# EasyEDA Pro project G474VET6_Penguins_v1.0.eprj

# Schematic Schematic1
Board Name: Board1
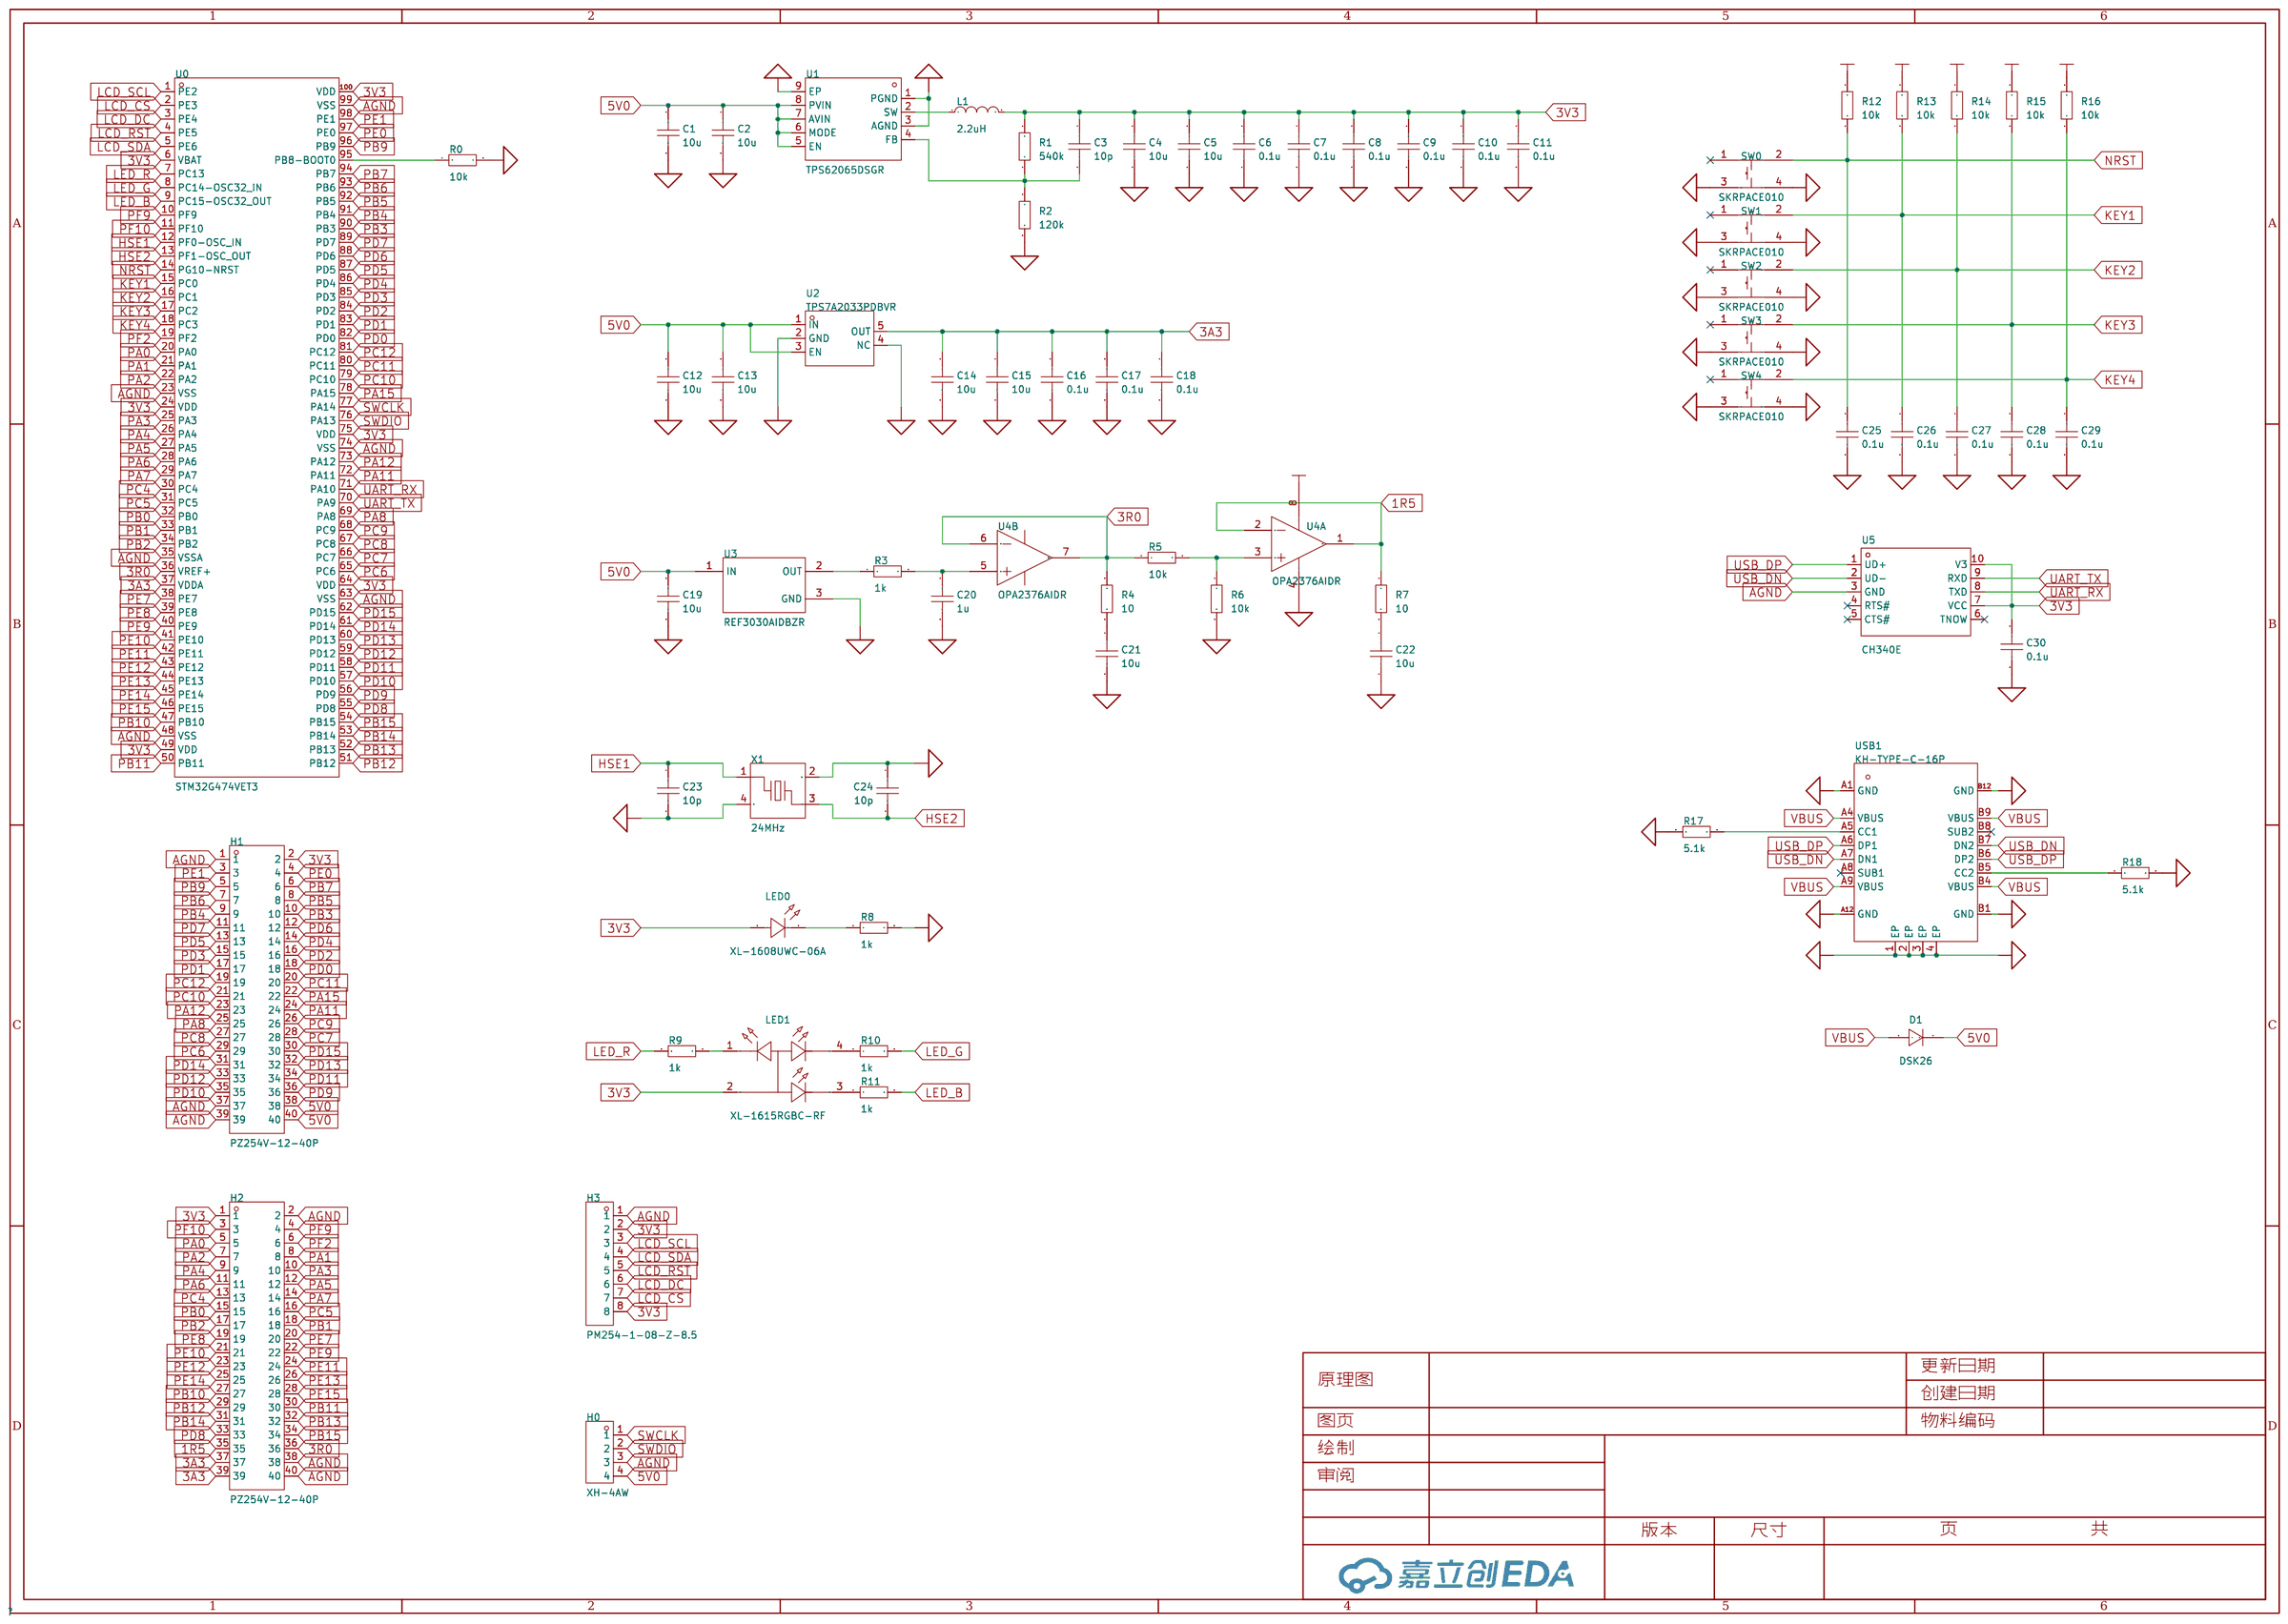
[diagram p0: schematic sheet]

## Parts
C1  10u  [R0603]
C2  10u  [R0603]
C3  10p  [R0603]
C4  10u  [R0603]
C5  10u  [R0603]
C6  0.1u  [R0603]
C7  0.1u  [R0603]
C8  0.1u  [R0603]
C9  0.1u  [R0603]
C10  0.1u  [R0603]
C11  0.1u  [R0603]
C12  10u  [R0603]
C13  10u  [R0603]
C14  10u  [R0603]
C15  10u  [R0603]
C16  0.1u  [R0603]
C17  0.1u  [R0603]
C18  0.1u  [R0603]
C19  10u  [R0603]
C20  1u  [R0603]
C21  10u  [R0603]
C22  10u  [R0603]
C23  10p  [R0603]
C24  10p  [R0603]
C25  0.1u  [R0603]
C26  0.1u  [R0603]
C27  0.1u  [R0603]
C28  0.1u  [R0603]
C29  0.1u  [R0603]
C30  0.1u  [R0603]
D1  DSK26  [SOD-123_L2.8-W1.8-LS3.7-RD]
H0  XH-4AW  [CONN-TH_XH-4AW]
H1  PZ254V-12-40P  [HDR-TH_40P-P2.54-V-M-R2-C20-S2.54_2-146257-0]
H2  PZ254V-12-40P  [HDR-TH_40P-P2.54-V-M-R2-C20-S2.54_2-146257-0]
H3  PM254-1-08-Z-8.5  [HDR-TH_8P-P2.54-V-F]
L1  2.2uH  [IND-SMD_L2.5-W2.0]
LED0  XL-1608UWC-06A  [LED0603-RD_1]
LED1  XL-1615RGBC-RF  [LED-ARRAY-SMD_4P-L1.6-W1.5-BR_XL-1615RGBC-RF]
R0  10k  [R0603]
R1  540k  [R0603]
R2  120k  [R0603]
R3  1k  [R0603]
R4  10  [R0603]
R5  10k  [R0603]
R6  10k  [R0603]
R7  10  [R0603]
R8  1k  [R0603]
R9  1k  [R0603]
R10  1k  [R0603]
R11  1k  [R0603]
R12  10k  [R0603]
R13  10k  [R0603]
R14  10k  [R0603]
R15  10k  [R0603]
R16  10k  [R0603]
R17  5.1k  [R0603]
R18  5.1k  [R0603]
SW0  SKRPACE010  [KEY-SMD_4P-L4.2-W3.2-P2.20-LS4.6]
SW1  SKRPACE010  [KEY-SMD_4P-L4.2-W3.2-P2.20-LS4.6]
SW2  SKRPACE010  [KEY-SMD_4P-L4.2-W3.2-P2.20-LS4.6]
SW3  SKRPACE010  [KEY-SMD_4P-L4.2-W3.2-P2.20-LS4.6]
SW4  SKRPACE010  [KEY-SMD_4P-L4.2-W3.2-P2.20-LS4.6]
U0  STM32G474VET3  [LQFP-100_L14.0-W14.0-P0.50-LS16.0-BL]
U1  TPS62065DSGR  [WSON-8_L2.0-W2.0-P0.65-BL-EP]
U2  TPS7A2033PDBVR  [SOT-23-5_L2.9-W1.6-P0.95-LS2.8-BR]
U3  REF3030AIDBZR  [SOT-23-3_L2.9-W1.6-P1.90-LS2.8-BR]
U4  OPA2376AIDR  [SOIC-8_L4.9-W3.9-P1.27-LS6.0-BL]  (sections 1,2)
U5  CH340E  [MSOP-10_L3.0-W3.0-P0.50-LS5.0-BL]
USB1  KH-TYPE-C-16P  [USB-C-SMD_KH-TYPE-C-16P]
X1  24MHz  [CRYSTAL-SMD_4P-L2.0-W1.6-BL]

## Library data of the parts
C1-C30 = CAP_0603: Supplier Footprint: 0603
D1 = DSK26_C50553: LCSC Part Name: 电压:60V 电流:2A; Supplier Part: C50553; Manufacturer: MDD(辰达半导体); Supplier Footprint: SOD-123FL; JLCPCB Part Class: 扩展库; Datasheet: https://atta.szlcsc.com/upload/public/pdf/source/20240710/2202812EA66BF191922452FAC369184A.pdf; Supplier: LCSC; Diode Configuration: 独立式; Forward Voltage (Vf@If): 700mV@2A; Reverse Voltage (Vr): 60V; Rectified Current: 2A; Reverse Leakage Current (Ir): 500uA@60V
H0 = XH-4AW: LCSC Part Name: 1x4P 间距:2.54mm 弯插 系列:XH; Supplier Part: C2908613; Manufacturer: HCTL(华灿天禄); Supplier Footprint: 弯插,P=2.5mm; JLCPCB Part Class: 扩展库; Datasheet: https://atta.szlcsc.com/upload/public/pdf/source/20230711/B565BAF3B11666EF6B81B3605408F2BD.pdf; Supplier: LCSC; Pins Structure: 1x4P; Pitch: 2.54mm; Mounting Style: 弯插; Reference Series: XH; Number of Pins: 4P; Number of Rows: 1; Number of PINs Per Row: 4; Current Rating (Max): 3A; Contact Material: 黄铜; Contact Plating: 锡; Operating Temperature Range: -25℃~+85℃
H1 H2 = PZ254V-12-40P: LCSC Part Name: 排针2.54mm间距 双排 2x20P 直插 方针; Supplier Part: C22465944; Manufacturer: XFCN(兴飞); Supplier Footprint: 插件,P=2.54mm; JLCPCB Part Class: 扩展库; Datasheet: https://atta.szlcsc.com/upload/public/pdf/source/20240617/7BDC3EEBCF4C501A0924363F71CB3FB4.pdf; Supplier: LCSC
H3 = PM254-1-08-Z-8.5: LCSC Part Name: 1x8P 间距:2.54mm 直插; Supplier Part: C2897371; Manufacturer: HCTL(华灿天禄); Supplier Footprint: 插件,P=2.54mm; JLCPCB Part Class: 扩展库; Datasheet: https://atta.szlcsc.com/upload/public/pdf/source/20230609/534BE42964C679BDE98E061007C4ABD6.pdf; Supplier: LCSC; Holes Structure: 1x8P; Pitch: 2.54mm; Circular Hole / Square Hole: 方孔; Mounting Type: 直插; Number of Rows: 单排; Number of Holes: 8P; Current Rating (Max): 3A; Holes Direction: 顶部; Insulation Height: 8.5mm; Contact Material: 铜合金; Operating Temperature Range: -40℃~+105℃; Soldering Temperature(Max): 260℃@5S
L1 = SMMS252010-2R2M: LCSC Part Name: 2.2uH ±20% 3A; Supplier Part: C5161635; Manufacturer: SXN(顺翔诺); Supplier Footprint: SMD,2x2.5mm; JLCPCB Part Class: 扩展库; Datasheet: https://atta.szlcsc.com/upload/public/pdf/source/20220915/1B56D3CEE5BC15077D1615000298C9B6.pdf; Supplier: LCSC; Tolerance: ±20%; Current - Saturation(Isat): 3A; DC Resistance(DCR): 70mΩ
LED0 = XL-1608UWC-06A: Supplier Part: C7371902; Manufacturer: XINGLIGHT(成兴光); Supplier Footprint: 0603; JLCPCB Part Class: Extended Part; Datasheet: https://atta.szlcsc.com/upload/public/pdf/source/20240218/5027756BA733C769FB74797569466480.pdf; Supplier: LCSC; Emitted Color: 白色; Forward Voltage (VF): 2.7V~3.1V; Power Dissipation: 75mW; Forward Current: 5mA; Lens Color: 黄色透镜; Color Temperature: 14000K; Luminous Intensity: 380mcd; Viewing Angle: 120°; Mounting Sytle: 正贴
LED1 = XL-1615RGBC-RF: Supplier Part: C965840; Manufacturer: XINGLIGHT(成兴光); Supplier Footprint: 0606; JLCPCB Part Class: Extended Part; Datasheet: https://atta.szlcsc.com/upload/public/pdf/source/20221102/F1B1FC7E45BA82C0C0D2B0679BEE9200.pdf; Supplier: LCSC; Diode Configuration: 共阳极; Viewing Angle: 120°; Lens Color: 无色透明; Installation Method: 正贴; Operating Temperature: -30℃~+85℃
R0-R18 = Res_0603: Supplier Footprint: 0603
SW0-SW4 = SKRPACE010: LCSC Part Name: 4.2*3.2*2.5mm 立贴 轻触开关; Supplier Part: C139797; Manufacturer: ALPSALPINE(阿尔卑斯阿尔派); Supplier Footprint: SMD; JLCPCB Part Class: 扩展库; Datasheet: https://atta.szlcsc.com/upload/public/pdf/source/20171113/C139797_15105612676371115729.pdf; Supplier: LCSC; Circuit: 单刀单掷; Actuator Style: 椭圆形按钮; Mounting Style: 立贴; Switch Length: 4.2mm; Switch Width: 3.2mm; Switch Height: 2.5mm; Contact Current: 50mA; Voltage Rating (DC): 16V
U0 = STM32G474VET3: LCSC Part Name: 带DSP和FPU的170MHz主流ARM Cortex-M4 MCU，具有512 KB Flash存储器、数学加速器、高分辨率定时器和高模拟电平集成; Supplier Part: C2970837; Manufacturer: ST(意法半导体); Supplier Footprint: LQFP-100(14x14); JLCPCB Part Class: 扩展库; Datasheet: https://atta.szlcsc.com/upload/public/pdf/source/20221107/1C05EB05E61A1774C91EF6DD7B13AC34.pdf; Supplier: LCSC; CPU Core: ARM-M系列; CPU Maximum Speed: 170MHz; Program Storage Size: 512KB; Number of I/O: 86; ADC (Bit): 12bit; DAC (Bit): 12bit; Low Voltage Detection Threshold: 1.71V~3.6V
U1 = TPS62065DSGR: LCSC Part Name: 3MHz 2A 同步降压转换器; Supplier Part: C398352; Manufacturer: TI(德州仪器); Supplier Footprint: WSON-8-EP(2x2); JLCPCB Part Class: 扩展库; Datasheet: https://www.ti.com/cn/lit/gpn/tps62065; Supplier: LCSC; Function: 降压型; Output Type: 可调; Input Voltage: 2.9V~6V; Output Current: 2A; Switching Frequency: 3MHz; Operating Temperature: -40℃~+125℃@(TJ); Synchronous Rectification: 是; Number of Outputs: 1; Topology: 降压式; Quiescent Current (Iq): 18uA; Switch tube (built-in/external): 内置
U2 = TPS7A2033PDBVR: LCSC Part Name: 具有高 PSRR 的 300mA、超低噪声、低 IQ、低压降 (LDO) 线性稳压器; Supplier Part: C2862740; Manufacturer: TI(德州仪器); Supplier Footprint: SOT-23-5; JLCPCB Part Class: Extended Part; Datasheet: https://www.ti.com/cn/lit/gpn/tps7a20; Supplier: LCSC; Output Type: 固定; Maximum Input Voltage: 6V; Output Voltage: 3.3V; Output Current: 300mA; Dropout Voltage: 140mV@(300mA); standby current: 15uA; Feature: 防静电保护；软启动；浪涌保护；低ESR；热保护(TSD)；欠压闭锁；过流保护(OCP)；带使能；防倒灌; Operating Temperature: -40℃~+125℃@(Tj); Output Polarity: 正极; Number of Outputs: 1
U3 = REF3030AIDBZR: Supplier Part: C38423; Manufacturer: TI(德州仪器); Supplier Footprint: SOT-23; JLCPCB Part Class: Extended Part; Datasheet: https://www.ti.com/cn/lit/gpn/ref3020; Supplier: LCSC; Output Type: 固定; Input Voltage: 3.05V~5.5V; Output Voltage: 3V; Output Current: 25mA; Tolerance: ±0.2%; Temperature Coefficient: 75ppm/℃; Reference Type: 串联; Supply Current: 50uA; Noise - 10Hz to 10kHz: 94uVrms; Operating Temperature: -40℃~+125℃@(Ta)
U4 = OPA2376AIDR: Supplier Part: C46316; Manufacturer: TI(德州仪器); Supplier Footprint: SOIC-8; JLCPCB Part Class: Extended Part; Datasheet: https://www.ti.com/cn/lit/gpn/opa376; Supplier: LCSC; Number of Circuits: 双路; Gain Bandwidth Product(GBP): 5.5MHz; Current - Input Bias(Ib): 0.2pA; Slew Rate(SR): 2V/us; Output Current: 50mA; Supply Current: 760uA; Operating Temperature: -40℃~+125℃
U5 = CH340E: LCSC Part Name: USB转串口芯片CH340; Supplier Part: C99652; Manufacturer: WCH(南京沁恒); Supplier Footprint: MSOP-10; JLCPCB Part Class: 扩展库; Datasheet: https://atta.szlcsc.com/upload/public/pdf/source/20240313/4FD4567B6A986AE079C4960D6CEBDDB5.pdf; Supplier: LCSC; Applications Function: 收发器; Protocol: USB 2.0; Supply Voltage: 3.3V；5V; Data Rate: 2Mbps
USB1 = KH-TYPE-C-16P: LCSC Part Name: Type-C 母 卧贴; Supplier Part: C709357; Manufacturer: kinghelm(金航标); Supplier Footprint: SMD; JLCPCB Part Class: 扩展库; Datasheet: https://atta.szlcsc.com/upload/public/pdf/source/20200911/C709357_AA8DCEB38BB20E3035A7ED7AE7667837.pdf; Supplier: LCSC; Connector Type: Type-C; Gender: 母; Number of Ports: 1; Number of Contacts: 16P; Mounting Style: 卧贴; Current Rating - Power (Max): 3A; Operating Temperature Range: -40℃~+85℃
X1 = XL7EL89CMI-111YLC-24M: LCSC Part Name: 24MHz ±10ppm 10pF; Supplier Part: C2965581; Manufacturer: YXC(扬兴晶振); Supplier Footprint: SMD2016-4P; JLCPCB Part Class: 扩展库; Datasheet: https://atta.szlcsc.com/upload/public/pdf/source/20240329/C26C9A15A73CBCFBF373B30A8E126750.pdf; Supplier: LCSC; Type: 贴片晶振; Normal temperature Frequency Tolerance: ±10ppm; Load Capacitance: 10pF; Frequency Stability: ±20ppm; Operating Temperature: -40℃~+85℃

## Nets
3V3: C3.1 C4.1 C5.1 C6.1 C7.1 C8.1 C9.1 C10.1 C11.1 C30.1 H1.2 H2.1 H3.2 H3.8 L1.2 LED0.2(A) LED1.2(COM+) R1.1 R12.1 R13.1 R14.1 R15.1 R16.1 U0.6(VBAT) U0.24(VDD) U0.49(VDD) U0.64(VDD) U0.75(VDD) U0.100(VDD) U5.7(VCC) U5.10(V3)
5V0: C1.1 C2.1 C12.1 C13.1 C19.1 D1.1(K) H0.4 H1.38 H1.40 U1.5(EN) U1.6(MODE) U1.7(AVIN) U1.8(PVIN) U2.1(IN) U2.3(EN) U3.1(IN)
AGND: C1.2 C2.2 C4.2 C5.2 C6.2 C7.2 C8.2 C9.2 C10.2 C11.2 C12.2 C13.2 C14.2 C15.2 C16.2 C17.2 C18.2 C19.2 C20.2 C21.2 C22.2 C23.2 C24.1 C25.2 C26.2 C27.2 C28.2 C29.2 C30.2 H0.3 H1.1 H1.37 H1.39 H2.2 H2.38 H2.40 H3.1 R0.2 R2.2 R6.2 R8.2 R17.2 R18.2 SW0.3 SW0.4 SW1.3 SW1.4 SW2.3 SW2.4 SW3.3 SW3.4 SW4.3 SW4.4 U0.23(VSS) U0.35(VSSA) U0.48(VSS) U0.63(VSS) U0.74(VSS) U0.99(VSS) U1.1(PGND) U1.3(AGND) U1.9(EP) U2.2(GND) U2.4(NC) U3.3(GND) U4.4(V-) U5.3(GND) USB1.1(EP) USB1.2(EP) USB1.3(EP) USB1.4(EP) USB1.A1(GND) USB1.A12(GND) USB1.B1(GND) USB1.B12(GND) X1.2(GND) X1.4(GND)
VBUS: D1.2(A) USB1.A4(VBUS) USB1.A9(VBUS) USB1.B4(VBUS) USB1.B9(VBUS)
1R5: H2.35 R7.1 U4.1(OUT A) U4.2(IN A-)
3A3: C14.1 C15.1 C16.1 C17.1 C18.1 H2.37 H2.39 U0.37(VDDA) U2.5(OUT) U4.8(V+)
3R0: H2.36 R4.1 R5.1 U0.36(VREF+) U4.6(IN B-) U4.7(OUT B)
HSE1: C23.1 U0.12(PF0-OSC_IN) X1.1
HSE2: C24.2 U0.13(PF1-OSC_OUT) X1.3
KEY1: C26.1 R13.2 SW1.2 U0.15(PC0)
KEY2: C27.1 R14.2 SW2.2 U0.16(PC1)
KEY3: C28.1 R15.2 SW3.2 U0.17(PC2)
KEY4: C29.1 R16.2 SW4.2 U0.18(PC3)
LCD_CS: H3.7 U0.2(PE3)
LCD_DC: H3.6 U0.3(PE4)
LCD_RST: H3.5 U0.4(PE5)
LCD_SCL: H3.3 U0.1(PE2)
LCD_SDA: H3.4 U0.5(PE6)
LED_B: R11.2 U0.9(PC15-OSC32_OUT)
LED_G: R10.2 U0.8(PC14-OSC32_IN)
LED_R: R9.2 U0.7(PC13)
NRST: C25.1 R12.2 SW0.2 U0.14(PG10-NRST)
PA0: H2.5 U0.20(PA0)
PA1: H2.8 U0.21(PA1)
PA2: H2.7 U0.22(PA2)
PA3: H2.10 U0.25(PA3)
PA4: H2.9 U0.26(PA4)
PA5: H2.12 U0.27(PA5)
PA6: H2.11 U0.28(PA6)
PA7: H2.14 U0.29(PA7)
PA8: H1.25 U0.69(PA8)
PA11: H1.24 U0.72(PA11)
PA12: H1.23 U0.73(PA12)
PA15: H1.22 U0.78(PA15)
PB0: H2.15 U0.32(PB0)
PB1: H2.18 U0.33(PB1)
PB2: H2.17 U0.34(PB2)
PB3: H1.10 U0.90(PB3)
PB4: H1.9 U0.91(PB4)
PB5: H1.8 U0.92(PB5)
PB6: H1.7 U0.93(PB6)
PB7: H1.6 U0.94(PB7)
PB9: H1.5 U0.96(PB9)
PB10: H2.27 U0.47(PB10)
PB11: H2.30 U0.50(PB11)
PB12: H2.29 U0.51(PB12)
PB13: H2.32 U0.52(PB13)
PB14: H2.31 U0.53(PB14)
PB15: H2.34 U0.54(PB15)
PC4: H2.13 U0.30(PC4)
PC5: H2.16 U0.31(PC5)
PC6: H1.29 U0.65(PC6)
PC7: H1.28 U0.66(PC7)
PC8: H1.27 U0.67(PC8)
PC9: H1.26 U0.68(PC9)
PC10: H1.21 U0.79(PC10)
PC11: H1.20 U0.80(PC11)
PC12: H1.19 U0.81(PC12)
PD0: H1.18 U0.82(PD0)
PD1: H1.17 U0.83(PD1)
PD2: H1.16 U0.84(PD2)
PD3: H1.15 U0.85(PD3)
PD4: H1.14 U0.86(PD4)
PD5: H1.13 U0.87(PD5)
PD6: H1.12 U0.88(PD6)
PD7: H1.11 U0.89(PD7)
PD8: H2.33 U0.55(PD8)
PD9: H1.36 U0.56(PD9)
PD10: H1.35 U0.57(PD10)
PD11: H1.34 U0.58(PD11)
PD12: H1.33 U0.59(PD12)
PD13: H1.32 U0.60(PD13)
PD14: H1.31 U0.61(PD14)
PD15: H1.30 U0.62(PD15)
PE0: H1.4 U0.97(PE0)
PE1: H1.3 U0.98(PE1)
PE7: H2.20 U0.38(PE7)
PE8: H2.19 U0.39(PE8)
PE9: H2.22 U0.40(PE9)
PE10: H2.21 U0.41(PE10)
PE11: H2.24 U0.42(PE11)
PE12: H2.23 U0.43(PE12)
PE13: H2.26 U0.44(PE13)
PE14: H2.25 U0.45(PE14)
PE15: H2.28 U0.46(PE15)
PF2: H2.6 U0.19(PF2)
PF9: H2.4 U0.10(PF9)
PF10: H2.3 U0.11(PF10)
SWCLK: H0.1 U0.77(PA14)
SWDIO: H0.2 U0.76(PA13)
UART_RX: U0.71(PA10) U5.8(TXD)
UART_TX: U0.70(PA9) U5.9(RXD)
USB_DN: U5.2(UD-) USB1.A7(DN1) USB1.B7(DN2)
USB_DP: U5.1(UD+) USB1.A6(DP1) USB1.B6(DP2)
$1N2300: R0.1 U0.95(PB8-BOOT0)
$1N6263: L1.1 U1.2(SW)
$1N6766: C3.2 R1.2 R2.1 U1.4(FB)
$1N7542: R3.1 U3.2(OUT)
$1N7546: C20.1 R3.2 U4.5(IN B+)
$1N7614: C21.1 R4.2
$1N7775: R5.2 R6.1 U4.3(IN A+)
$1N7848: C22.1 R7.2
$1N8290: LED0.1(K) R8.1
$1N8423: LED1.4(G-) R10.1
$1N8449: LED1.3(B-) R11.1
$1N8483: LED1.1(R-) R9.1
$1N10078: R17.1 USB1.A5(CC1)
$1N10082: R18.1 USB1.B5(CC2)

Not connected (* = marked no-connect by the designer): SW0 1*; SW1 1*; SW2 1*; SW3 1*; SW4 1*; U5 4(RTS#)* 5(CTS#)* 6(TNOW)*; USB1 A8(SUB1)* B8(SUB2)*

# Board PCB1
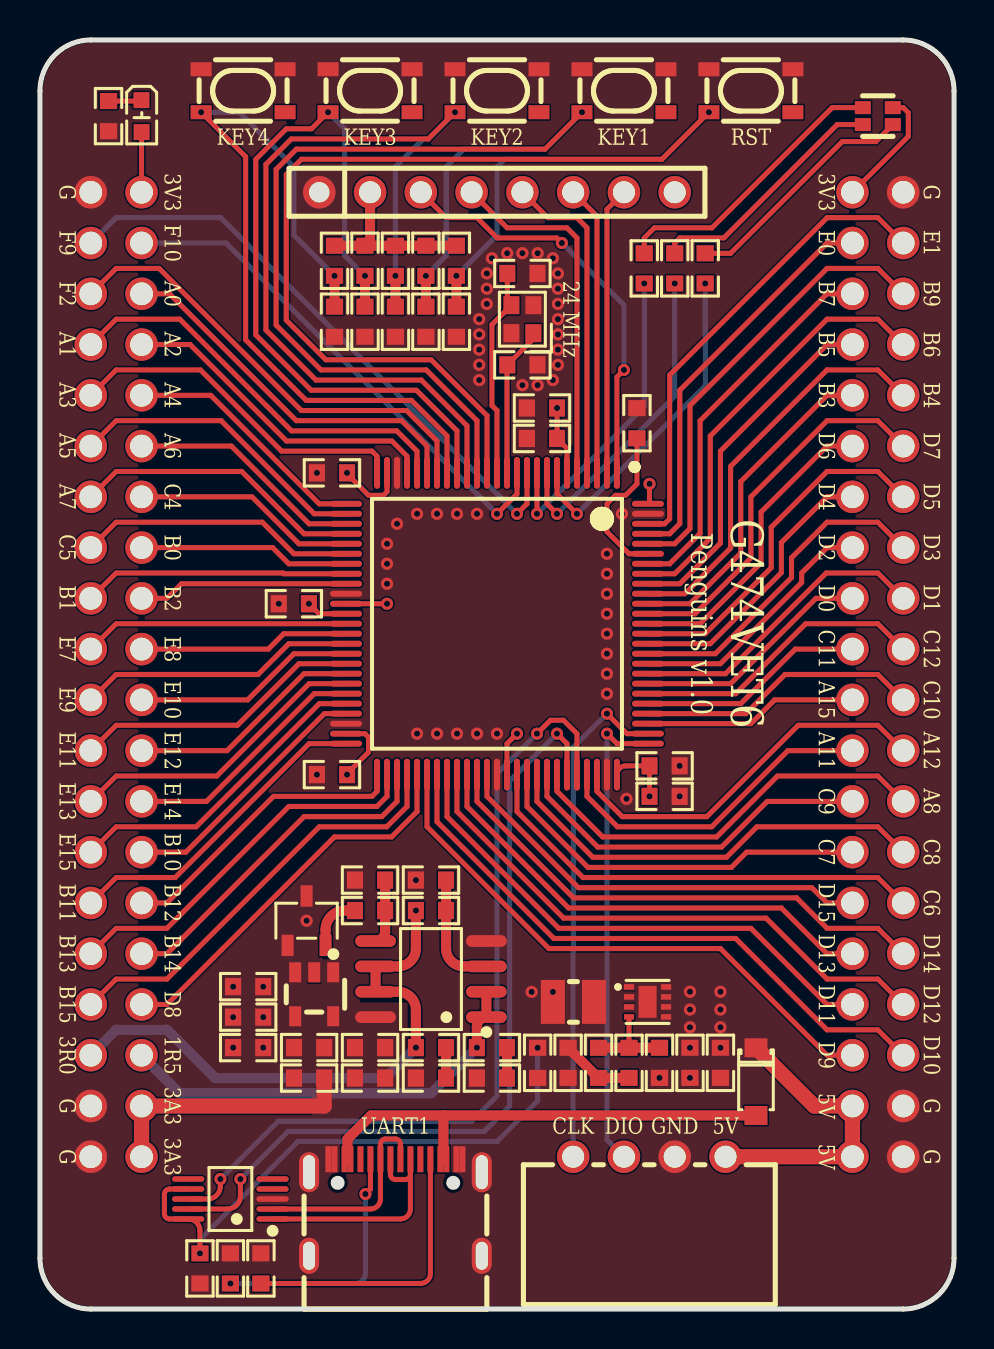
[diagram p1: board, top side]
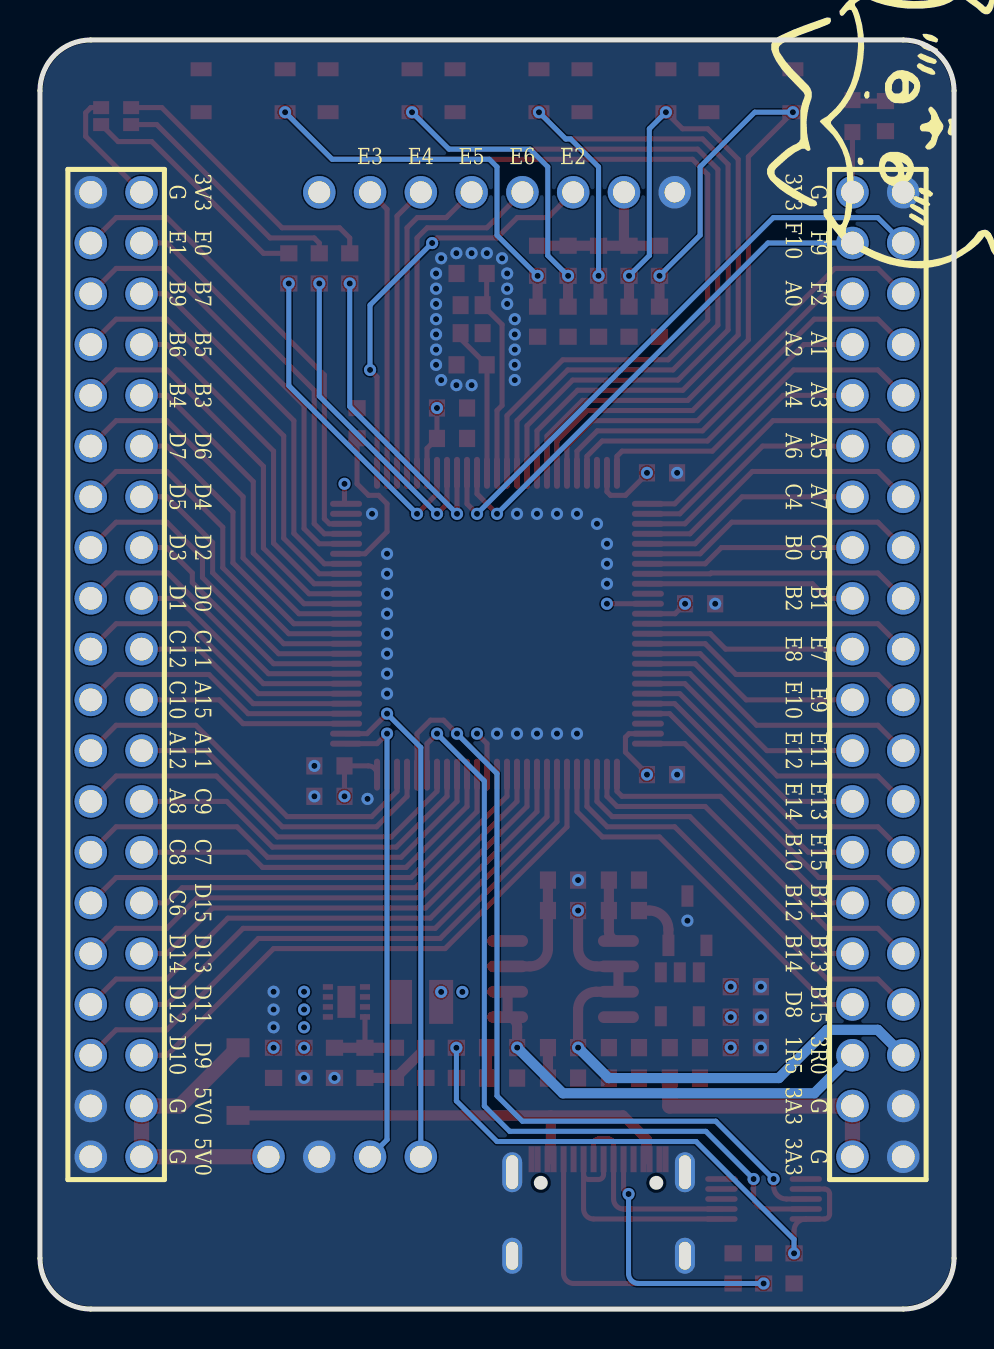
[diagram p2: board, bottom side, seen from below]

Outline 45.72 x 63.5 mm; copper layers: Top Layer, Inner1, Inner2, Bottom Layer. Coordinates in mm from the lower left corner of the outline.
Outline path: 0,60.96 0,2.54 arc(0.74,0.74) 2.54,0 43.18,0 arc(44.98,0.74) 45.72,2.54 45.72,60.96 arc(44.98,62.76) 43.18,63.5 2.54,63.5 arc(0.74,62.76) 0,60.96
Stack: Top Layer 0.035mm 外层铜厚1oz / Dielectric1 0.2104mm 7628 RC49% 8.6mil / Inner1 0.0152mm 内层铜厚 / Dielectric2 1.065mm 1.1mm H/HOZ Copper / Inner2 0.0152mm 内层铜厚 / Dielectric3 0.2104mm 7628 RC49% 8.6mil / Bottom Layer 0.035mm 外层铜厚1oz

## Design rules (mm)
template: 自定义配置
spacing copperThickness1oz (default): track to track 0.102, other pairs 0.152 to 0.3
spacing copperThickness2oz: track to track 0.203, other pairs 0.152 to 0.3
track width copperThickness1oz (default): min 0.127, default 0.254, max 2.54
track width copperThickness2oz: min 0.203, default 0.254, max 2.54
differential pair differentialPair (default): width min 0.127, default 0.254, max 2.54; gap min 0.152, default 0.152
via viaSize (default): diameter min 0.5, default 0.61, max 10; hole min 0.3, default 0.305, max 6.299

## Placement (name value [footprint] x y rotation side)
C1  10u  [R0603]  34.04 12.32 270 top
C2  10u  [R0603]  32.51 12.32 270 top
C3  10p  [R0603]  27.94 12.32 90 top
C4  10u  [R0603]  26.42 12.32 270 top
C5  10u  [R0603]  24.89 12.32 270 top
C6  0.1u  [R0603]  14.61 41.84 180 top
C7  0.1u  [R0603]  14.61 26.74 180 top
C8  0.1u  [R0603]  31.24 27.18 0 top
C9  0.1u  [R0603]  31.24 25.65 0 top
C10  0.1u  [R0603]  25.11 43.56 180 top
C11  0.1u  [R0603]  25.11 45.08 180 top
C12  10u  [R0603]  10.41 16.13 180 top
C13  10u  [R0603]  10.41 14.6 180 top
C14  10u  [R0603]  13.46 13.08 180 top
C15  10u  [R0603]  13.46 11.56 180 top
C16  0.1u  [R0603]  16.51 13.08 0 top
C17  0.1u  [R0603]  16.51 11.56 0 top
C18  0.1u  [R0603]  12.7 35.29 180 top
C19  10u  [R0603]  10.41 13.08 180 top
C20  1u  [R0603]  16.51 21.46 180 top
C21  10u  [R0603]  19.56 11.56 180 top
C22  10u  [R0603]  22.61 11.56 180 top
C23  10p  [R0603]  24.13 47.24 0 top
C24  10p  [R0603]  24.13 51.82 180 top
C25  0.1u  [R0603]  20.83 49.4 270 top
C26  0.1u  [R0603]  19.3 49.4 270 top
C27  0.1u  [R0603]  17.78 49.4 270 top
C28  0.1u  [R0603]  16.26 49.4 270 top
C29  0.1u  [R0603]  14.73 49.4 270 top
C30  0.1u  [R0603]  8 2.03 270 top
D1  DSK26  [SOD-123_L2.8-W1.8-LS3.7-RD]  35.81 11.38 270 top
H0  XH-4AW  [CONN-TH_XH-4AW]  30.48 7.62 0 top
H1  PZ254V-12-40P  [HDR-TH_40P-P2.54-V-M-R2-C20-S2.54_2-146257-0]  41.91 31.75 270 bottom
H2  PZ254V-12-40P  [HDR-TH_40P-P2.54-V-M-R2-C20-S2.54_2-146257-0]  3.81 31.75 270 bottom
H3  PM254-1-08-Z-8.5  [HDR-TH_8P-P2.54-V-F]  22.86 55.88 0 top
L1  2.2uH  [IND-SMD_L2.5-W2.0]  26.68 15.37 0 top
LED0  XL-1608UWC-06A  [LED0603-RD_1]  5.08 59.69 270 top
LED1  XL-1615RGBC-RF  [LED-ARRAY-SMD_4P-L1.6-W1.5-BR_XL-1615RGBC-RF]  41.91 59.69 0 top
R0  10k  [R0603]  29.86 44.32 90 top
R1  540k  [R0603]  29.46 12.32 90 top
R2  120k  [R0603]  30.99 12.32 270 top
R3  1k  [R0603]  16.51 19.94 0 top
R4  10  [R0603]  19.56 13.08 0 top
R5  10k  [R0603]  19.56 19.94 0 top
R6  10k  [R0603]  19.56 21.46 180 top
R7  10  [R0603]  22.61 13.08 0 top
R8  1k  [R0603]  3.43 59.69 270 top
R9  1k  [R0603]  33.27 52.07 270 top
R10  1k  [R0603]  31.75 52.07 270 top
R11  1k  [R0603]  30.23 52.07 270 top
R12  10k  [R0603]  20.83 52.45 270 top
R13  10k  [R0603]  19.3 52.45 270 top
R14  10k  [R0603]  17.78 52.45 270 top
R15  10k  [R0603]  16.26 52.45 270 top
R16  10k  [R0603]  14.73 52.45 270 top
R17  5.1k  [R0603]  9.52 2.03 90 top
R18  5.1k  [R0603]  11.05 2.03 90 top
SW0  SKRPACE010  [KEY-SMD_4P-L4.2-W3.2-P2.20-LS4.6]  35.56 60.96 180 top
SW1  SKRPACE010  [KEY-SMD_4P-L4.2-W3.2-P2.20-LS4.6]  29.21 60.96 180 top
SW2  SKRPACE010  [KEY-SMD_4P-L4.2-W3.2-P2.20-LS4.6]  22.86 60.96 180 top
SW3  SKRPACE010  [KEY-SMD_4P-L4.2-W3.2-P2.20-LS4.6]  16.51 60.96 180 top
SW4  SKRPACE010  [KEY-SMD_4P-L4.2-W3.2-P2.20-LS4.6]  10.16 60.96 180 top
U0  STM32G474VET3  [LQFP-100_L14.0-W14.0-P0.50-LS16.0-BL]  22.86 34.29 180 top
U1  TPS62065DSGR  [WSON-8_L2.0-W2.0-P0.65-BL-EP]  30.39 15.37 270 top
U2  TPS7A2033PDBVR  [SOT-23-5_L2.9-W1.6-P0.95-LS2.8-BR]  13.72 15.75 90 top
U3  REF3030AIDBZR  [SOT-23-3_L2.9-W1.6-P1.90-LS2.8-BR]  13.33 19.43 270 top
U4  OPA2376AIDR  [SOIC-8_L4.9-W3.9-P1.27-LS6.0-BL]  19.56 16.51 90 top
U5  CH340E  [MSOP-10_L3.0-W3.0-P0.50-LS5.0-BL]  9.52 5.5 90 top
USB1  KH-TYPE-C-16P  [USB-C-SMD_KH-TYPE-C-16P]  17.78 5.08 0 top
X1  24MHz  [CRYSTAL-SMD_4P-L2.0-W1.6-BL]  24.13 49.53 90 top

## Footprints (pads in the part's own frame, mm; a bottom-side part is the same pattern mirrored in y, then rotated)
CONN-TH_XH-4AW
  round 1.625 hole 1.1x1.016: 1(-3.81,0) 2(-1.27,0) 3(1.27,0) 4(3.81,0)
CRYSTAL-SMD_4P-L2.0-W1.6-BL
  rect 0.9x0.8 smd: 1(-0.7,-0.55) 2(0.7,-0.55) 3(0.7,0.55) 4(-0.7,0.55)
HDR-TH_8P-P2.54-V-F
  round 1.625 hole 1.016x1.1: 1(-8.89,0)
  round 1.625 hole 1.1x1.016: 2(-6.35,0) 3(-3.81,0) 4(-1.27,0) 5(1.27,0) 6(3.81,0) 7(6.35,0) 8(8.89,0)
HDR-TH_40P-P2.54-V-M-R2-C20-S2.54_2-146257-0
  round 1.625 hole 1.14x1.016: 1(-24.13,-1.27) 2(-24.13,1.27) 3(-21.59,-1.27) 4(-21.59,1.27) 5(-19.05,-1.27) 6(-19.05,1.27) 7(-16.51,-1.27) 8(-16.51,1.27) 9(-13.97,-1.27) 10(-13.97,1.27) 11(-11.43,-1.27) 12(-11.43,1.27) 13(-8.89,-1.27) 14(-8.89,1.27) 15(-6.35,-1.27) 16(-6.35,1.27) 17(-3.81,-1.27) 18(-3.81,1.27) 19(-1.27,-1.27) 20(-1.27,1.27) 21(1.27,-1.27) 22(1.27,1.27) 23(3.81,-1.27) 24(3.81,1.27) 25(6.35,-1.27) 26(6.35,1.27) 27(8.89,-1.27) 28(8.89,1.27) 29(11.43,-1.27) 30(11.43,1.27) 31(13.97,-1.27) 32(13.97,1.27) 33(16.51,-1.27) 34(16.51,1.27) 35(19.05,-1.27) 36(19.05,1.27) 37(21.59,-1.27) 38(21.59,1.27) 39(24.13,-1.27) 40(24.13,1.27)
IND-SMD_L2.5-W2.0
  rect 1.2x2.2 smd: 1(1.028,0) 2(-1.028,0)
KEY-SMD_4P-L4.2-W3.2-P2.20-LS4.6
  rect 1.05x0.7 smd: 1(-2.1,1.075) 2(2.1,1.075) 3(-2.1,-1.075) 4(2.1,-1.075)
LED0603-RD_1
  rect 0.8x0.8 smd: 1(-0.799,-0.004) 2(0.799,0.004)
LED-ARRAY-SMD_4P-L1.6-W1.5-BR_XL-1615RGBC-RF
  rect 0.8x0.65 smd: 1(0.75,-0.425) 2(0.75,0.425) 3(-0.75,0.425) 4(-0.75,-0.425)
LQFP-100_L14.0-W14.0-P0.50-LS16.0-BL
  oval 0.3x1.6 smd: 1(-6,-7.55) 2(-5.5,-7.55) 3(-5,-7.55) 4(-4.5,-7.55) 5(-4,-7.55) 6(-3.5,-7.55) 7(-3,-7.55) 8(-2.5,-7.55) 9(-2,-7.55) 10(-1.5,-7.55) 11(-1,-7.55) 12(-0.5,-7.55) 13(0,-7.55) 14(0.5,-7.55) 15(1,-7.55) 16(1.5,-7.55) 17(2,-7.55) 18(2.5,-7.55) 19(3,-7.55) 20(3.5,-7.55) 21(4,-7.55) 22(4.5,-7.55) 23(5,-7.55) 24(5.5,-7.55) 25(6,-7.55) 51(6,7.55) 52(5.5,7.55) 53(5,7.55) 54(4.5,7.55) 55(4,7.55) 56(3.5,7.55) 57(3,7.55) 58(2.5,7.55) 59(2,7.55) 60(1.5,7.55) 61(1,7.55) 62(0.5,7.55) 63(0,7.55) 64(-0.5,7.55) 65(-1,7.55) 66(-1.5,7.55) 67(-2,7.55) 68(-2.5,7.55) 69(-3,7.55) 70(-3.5,7.55) 71(-4,7.55) 72(-4.5,7.55) 73(-5,7.55) 74(-5.5,7.55) 75(-6,7.55)
  oval 1.6x0.3 smd: 26(7.55,-6) 27(7.55,-5.5) 28(7.55,-5) 29(7.55,-4.5) 30(7.55,-4) 31(7.55,-3.5) 32(7.55,-3) 33(7.55,-2.5) 34(7.55,-2) 35(7.55,-1.5) 36(7.55,-1) 37(7.55,-0.5) 38(7.55,0) 39(7.55,0.5) 40(7.55,1) 41(7.55,1.5) 42(7.55,2) 43(7.55,2.5) 44(7.55,3) 45(7.55,3.5) 46(7.55,4) 47(7.55,4.5) 48(7.55,5) 49(7.55,5.5) 50(7.55,6) 76(-7.55,6) 77(-7.55,5.5) 78(-7.55,5) 79(-7.55,4.5) 80(-7.55,4) 81(-7.55,3.5) 82(-7.55,3) 83(-7.55,2.5) 84(-7.55,2) 85(-7.55,1.5) 86(-7.55,1) 87(-7.55,0.5) 88(-7.55,0) 89(-7.55,-0.5) 90(-7.55,-1) 91(-7.55,-1.5) 92(-7.55,-2) 93(-7.55,-2.5) 94(-7.55,-3) 95(-7.55,-3.5) 96(-7.55,-4) 97(-7.55,-4.5) 98(-7.55,-5) 99(-7.55,-5.5) 100(-7.55,-6)
MSOP-10_L3.0-W3.0-P0.50-LS5.0-BL
  oval 0.28x1.62 smd: 1(-1,-2.11) 2(-0.5,-2.11) 3(0,-2.11) 4(0.5,-2.11) 5(1,-2.11) 6(1,2.11) 7(0.5,2.11) 8(0,2.11) 9(-0.5,2.11) 10(-1,2.11)
R0603
  rect 0.806x0.864 smd: 1(-0.753,0) 2(0.753,0)
SOD-123_L2.8-W1.8-LS3.7-RD
  rect 0.95x1.15 smd: 1(-1.692,0) 2(1.692,0)
SOIC-8_L4.9-W3.9-P1.27-LS6.0-BL
  oval 0.588x2.045 smd: 1(-1.905,-2.772) 2(-0.635,-2.772) 3(0.635,-2.772) 4(1.905,-2.772) 5(1.905,2.772) 6(0.635,2.772) 7(-0.635,2.772) 8(-1.905,2.772)
SOT-23-3_L2.9-W1.6-P1.90-LS2.8-BR
  rect 1.07x0.6 smd: 1(1.235,-0.95) 2(1.235,0.95) 3(-1.235,0)
SOT-23-5_L2.9-W1.6-P0.95-LS2.8-BR
  rect 1x0.6 smd: 1(1.1,-0.95) 2(1.1,0) 3(1.1,0.95) 4(-1.1,0.95) 5(-1.1,-0.95)
USB-C-SMD_KH-TYPE-C-16P
  oval 1x2 hole 0.6x1.7: 1(-4.32,1.765) 2(4.32,1.765)
  oval 1x1.8 hole 0.6x1.4: 3(-4.32,-2.415) 4(4.32,-2.415)
  rect 0.3x1.3 smd: A1(-3.35,2.415) A4(-2.55,2.415) A5(-1.25,2.415) A6(-0.25,2.415) A7(0.25,2.415) A8(1.25,2.415) A9(2.55,2.415) A12(3.35,2.415) B1(3.05,2.415) B4(2.25,2.415) B5(1.75,2.415) B6(0.75,2.415) B7(-0.75,2.415) B8(-1.75,2.415) B9(-2.25,2.415) B12(-3.05,2.415)
WSON-8_L2.0-W2.0-P0.65-BL-EP
  rect 0.28x0.505 smd: 1(-0.75,-0.927) 2(-0.25,-0.927) 3(0.25,-0.927) 4(0.75,-0.927) 5(0.75,0.927) 6(0.25,0.927) 7(-0.25,0.927) 8(-0.75,0.927)
  rect 1.6x0.9 smd: 9(0,0)

## Nets
As in the schematic.

Pads without a net: SW0 1; SW1 1; SW2 1; SW3 1; SW4 1; U5 4 5 6; USB1 A8 B8

## Via types
v1: diameter 0.61, hole 0.305, Top Layer to Bottom Layer, 112 vias

## Routing (per net, layer and track width the routed paths; a pad name or vN(x,y) marks a point on that pad's centre or on a via; arc(x,y) is an arc through that point)
3V3: length 211.6
  Top Layer w0.254: v1(25.86,45.08) C10.1 26.36,43.06 U0.6 ; U0.64 23.36,28.29 v1(23.86,28.79) ; 27.92,11.57 C3.1 ; U0.24 17.36,40.89 17.18,40.71 16.44,40.71 15.36,41.79 v1(15.36,41.84) ; v1(30.49,41.29) 30.49,40.37 arc(30.47,40.31) U0.100 ; H2.1 5.08,58.89 LED0.2 ; v1(30.49,25.65) C8.1 29.3,27.18 arc(28.99,27.05) U0.75 ; LED1.2 43.18,60.11 43.43,59.86 43.43,58.67 H1.2 ; 7.42,6 6.48,6 arc(6.3,5.93) 6.22,5.75 6.22,4.76 arc(6.3,4.58) 6.48,4.5 7.42,4.5 arc(7.83,4.33) 8,3.92 v1(8,2.79) ; U0.49 16.26,28.79 16.44,28.61 16.44,27.87 15.36,26.79 v1(15.36,26.74)
  Top Layer w0.508: H3.2 16.51,53.2 ; 16.51,53.2 R14.1 R13.1 R12.1 ; 16.51,53.2 R15.1 R16.1 ; C4.1 27.92,11.57 ; C3.1 R1.1
  Inner2 w0.762: v1(23.86,28.79) 23.86,15.87 ; 23.86,15.87 16.63,15.87 arc(15.73,16.24) 15.36,17.14 v1(15.36,26.74) v1(15.36,41.84) 15.36,45.6 H2.1 6.98,57.78 14.61,57.78 H3.2 ; 23.86,15.87 v1(24.59,15.87) v1(25.65,15.87) 29.22,15.87 arc(30.12,16.24) 30.49,17.14 v1(30.49,25.65) v1(30.49,41.29) ; v1(30.49,41.29) 30.49,45.73 H1.2 H3.8 ; v1(30.49,41.29) arc(29.38,43.97) 26.69,45.08 v1(25.86,45.08)
  Bottom Layer w0.254: v1(8,2.79) 8,3.48 12.9,8.38 22.86,8.38 24.89,10.41 v1(24.89,13.07)
5V0: length 43.6
  Top Layer w0.762: H0.4 H1.40 H1.38 38.73,10.16 D1.1
  Inner2 w0.762: v1(34.04,13.07) v1(32.51,13.07) v1(32.51,14.1) 32.51,14.6 ; v1(11.17,14.6) v1(11.17,16.13) ; v1(11.17,14.6) 32.51,14.6 ; v1(11.17,14.6) v1(11.17,13.08) ; 32.51,14.6 v1(32.51,14.99) v1(32.51,15.87)
AGND:
  vias: v1(9.66,16.13) v1(9.66,14.6) v1(9.66,13.08) v1(11.95,35.29) v1(13.33,19.43) v1(13.85,41.84) v1(13.85,26.74) v1(17.36,38.29) v1(17.36,37.29) v1(17.36,36.29) v1(17.86,39.29) v1(18.8,21.46) v1(18.86,39.79) v1(18.86,28.79) v1(19.86,39.79) v1(19.86,28.79) v1(20.86,39.79) v1(20.86,28.79) v1(21.86,39.79) v1(21.86,28.79) v1(21.97,49.53) v1(21.97,48.77) v1(21.97,48.01) v1(21.97,47.24) v1(21.97,46.48) v1(22.35,51.82) v1(22.35,51.05) v1(22.35,50.29) v1(22.61,52.58) v1(22.86,28.79) v1(23.37,52.83) v1(24.13,52.83) v1(24.13,46.23) v1(24.89,52.83) v1(24.89,46.23) v1(25.65,52.58) v1(25.65,46.48) v1(25.91,51.82) v1(25.91,51.05) v1(25.91,50.29) v1(25.91,49.53) v1(25.91,48.77) v1(25.91,48.01) v1(25.91,47.24) v1(28.36,37.79) v1(28.36,36.79) v1(28.36,35.79) v1(28.36,34.79) v1(28.36,33.79) v1(28.36,32.79) v1(28.36,31.79) v1(28.36,30.79) v1(29.11,39.79) v1(29.34,25.53) v1(30.99,11.57) v1(32,27.18) v1(32,25.65) v1(32.51,11.57) v1(34.04,15.87) v1(34.04,14.99) v1(34.04,14.1)
VBUS: length 24.1
  Top Layer w0.508: 20.18,9.69 16.56,9.69 15.38,8.51 15.38,7.49 ; 20.18,9.69 D1.2 ; 20.18,9.69 20.18,7.49
1R5: length 21.6
  Top Layer w0.508: U4.2 U4.1 arc(21.99,14.46) 21.85,14.13 v1(21.85,13.08)
  Bottom Layer w0.508: H2.35 6.98,10.79 19.57,10.79 v1(21.85,13.08)
3A3: length 43.7
  Top Layer w0.254: U0.37 13.95,34.79 v1(13.45,35.29)
  Top Layer w0.762: H2.39 H2.37 14.22,10.16 C15.1
  Inner2 w0.762: v1(13.45,35.29) 7.62,29.46 7.62,12.7 H2.37
3R0: length 46.5
  Top Layer w0.254: U0.36 v1(17.36,35.29)
  Top Layer w0.508: v1(18.8,19.94) 18.8,18.04 arc(18.54,17.41) 17.91,17.14 U4.6 U4.7 17.91,15.87 arc(18.54,15.61) 18.8,14.98 v1(18.8,13.08)
  Inner2 w0.508: v1(18.8,19.94) 17.36,21.38 v1(17.36,35.29)
  Bottom Layer w0.508: H2.36 3.81,13.97 6.35,13.97 8.76,11.56 17.28,11.56 v1(18.8,13.08)
HSE1: length 7.5
  Top Layer w0.254: X1.1 24.68,48.55 C23.1 23.36,47.23 U0.12
HSE2: length 10.6
  Top Layer w0.254: U0.13 22.86,44.96 22.61,45.21 22.61,49.26 X1.3 23.38,50.43 C24.2
KEY1: length 54.3
  Top Layer w0.254: U0.15 21.86,44.45 19.32,46.99 14.05,46.99 11.81,49.23 11.81,57.02 12.83,58.04 25.26,58.04 v1(27.11,59.88)
  Top Layer w0.508: v1(19.3,51.7) C26.1
  Bottom Layer w0.254: v1(19.3,51.7) 20.32,52.71 20.32,57.15 21.21,58.04 25.26,58.04 v1(27.11,59.88)
KEY2: length 44.3
  Top Layer w0.254: v1(20.76,59.88) 19.42,58.55 12.57,58.55 11.3,57.28 11.3,48.99 13.81,46.48 19.07,46.48 21.36,44.2 U0.16
  Top Layer w0.508: v1(17.78,51.7) C27.1
  Bottom Layer w0.254: v1(20.76,59.88) 19.42,58.55 19.18,58.55 17.78,57.15 v1(17.78,51.7)
KEY3: length 38
  Top Layer w0.254: v1(14.41,59.88) 13.58,59.05 12.32,59.05 10.8,57.53 10.8,48.74 13.56,45.97 18.83,45.97 20.86,43.94 U0.17
  Top Layer w0.508: v1(16.26,51.7) C28.1
  Bottom Layer w0.254: v1(16.26,51.7) 15.24,52.71 15.24,59.05 v1(14.41,59.88)
KEY4: length 39.8
  Top Layer w0.254: U0.18 20.36,43.69 18.58,45.47 13.32,45.47 10.29,48.5 10.29,57.66 v1(8.06,59.88)
  Top Layer w0.508: v1(14.73,51.7) C29.1
  Bottom Layer w0.254: v1(14.73,51.7) 12.7,53.73 12.7,57.15 9.96,59.88 v1(8.06,59.88)
LCD_CS: length 14.4
  Top Layer w0.254: H3.7 28.36,55.03 U0.2
LCD_DC: length 14.5
  Top Layer w0.254: U0.3 27.86,54.69 H3.6
LCD_RST: length 16.2
  Top Layer w0.254: U0.4 27.36,54.1 26.85,54.61 25.4,54.61 H3.5
LCD_SCL: length 21
  Top Layer w0.254: U0.1 28.86,46.64 v1(29.21,46.99) ; H3.3 20.32,54.61 21.85,54.61 22.87,53.59 25.85,53.59 v1(26.11,53.34)
  Bottom Layer w0.254: v1(26.11,53.34) 29.21,50.24 v1(29.21,46.99)
LCD_SDA: length 18
  Top Layer w0.254: H3.4 23.37,54.1 26.35,54.1 26.86,53.59 U0.5
LED_B: length 15.8
  Top Layer w0.254: U0.9 v1(24.86,39.79)
  Bottom Layer w0.254: v1(24.86,39.79) 30.23,45.16 v1(30.23,51.32)
LED_G: length 16.2
  Top Layer w0.254: U0.8 25.36,40.29 v1(25.86,39.79)
  Bottom Layer w0.254: v1(25.86,39.79) 31.75,45.68 v1(31.75,51.32)
LED_R: length 16.6
  Top Layer w0.254: v1(26.86,39.79) 25.86,40.79 U0.7
  Bottom Layer w0.254: v1(26.86,39.79) 33.27,46.2 v1(33.27,51.32)
NRST: length 64.2
  Top Layer w0.254: v1(33.46,59.88) 31.11,57.53 13.08,57.53 12.32,56.77 12.32,49.48 14.3,47.5 19.57,47.5 22.36,44.7 U0.14
  Top Layer w0.508: v1(20.83,51.7) C25.1
  Bottom Layer w0.254: v1(20.83,51.7) 22.86,53.73 22.86,57.15 23.24,57.53 31.11,57.53 v1(33.46,59.88)
PA0: length 18.8
  Top Layer w0.254: H2.5 6.48,50.8 12.83,44.45 18.09,44.45 19.36,43.18 U0.20
PA1: length 20.7
  Top Layer w0.254: U0.21 18.86,42.93 17.84,43.94 12.58,43.94 6.99,49.53 3.81,49.53 H2.8
PA2: length 16.4
  Top Layer w0.254: U0.22 18.36,42.67 17.6,43.43 12.33,43.43 7.51,48.26 H2.7
PA3: length 17.5
  Top Layer w0.254: U0.25 16.86,42.67 16.61,42.93 12.09,42.93 8.02,46.99 3.81,46.99 H2.10
PA4: length 12.5
  Top Layer w0.254: H2.9 8.54,45.72 13.97,40.29 U0.26
PA5: length 15.2
  Top Layer w0.254: H2.12 3.81,44.45 9.06,44.45 13.72,39.79 U0.27
PA6: length 11.8
  Top Layer w0.254: H2.11 9.57,43.18 13.46,39.29 U0.28
PA7: length 14.6
  Top Layer w0.254: H2.14 3.81,41.91 10.09,41.91 13.21,38.79 U0.29
PA8: length 20.9
  Top Layer w0.254: U0.69 25.86,25.91 28.15,23.62 33.85,23.62 36.89,26.67 41.91,26.67 H1.25
PA11: length 16.6
  Top Layer w0.254: H1.24 37.41,27.94 33.6,24.13 28.88,24.13 27.36,25.65 U0.72
PA12: length 19.1
  Top Layer w0.254: U0.73 27.86,25.91 29.13,24.64 33.35,24.64 37.93,29.21 41.91,29.21 H1.23
PA15: length 10.7
  Top Layer w0.254: U0.78 35.56,29.29 36.75,30.48 H1.22
PB0: length 10.6
  Top Layer w0.254: U0.32 12.45,37.29 11.64,38.1 H2.15
PB1: length 13.3
  Top Layer w0.254: H2.18 3.81,36.83 12.15,36.83 12.19,36.79 U0.33
PB2: length 10.5
  Top Layer w0.254: H2.17 6.35,35.56 7.08,36.29 U0.34
PB3: length 16.6
  Top Layer w0.254: H1.10 39.37,45.72 35.05,41.4 35.05,37.83 32.51,35.29 U0.90
PB4: length 20.3
  Top Layer w0.254: U0.91 32.26,35.79 34.54,38.08 34.54,42.16 39.37,46.99 41.91,46.99 H1.9
PB5: length 17.9
  Top Layer w0.254: U0.92 32,36.29 34.04,38.32 34.04,42.93 39.37,48.26 H1.8
PB6: length 21.6
  Top Layer w0.254: H1.7 41.91,49.53 39.37,49.53 33.53,43.69 33.53,38.57 31.75,36.79 U0.93
PB7: length 19.1
  Top Layer w0.254: U0.94 31.5,37.29 33.02,38.81 33.02,44.45 39.37,50.8 H1.6
PB9: length 22.6
  Top Layer w0.254: U0.96 31.75,38.29 32.51,39.05 32.51,45.21 39.37,52.07 41.91,52.07 H1.5
PB10: length 13.1
  Top Layer w0.254: U0.47 14.22,29.79 7.29,22.86 H2.27
PB11: length 16.1
  Top Layer w0.254: H2.30 3.81,21.59 6.76,21.59 13.46,28.29 U0.50
PB12: length 14.9
  Top Layer w0.254: U0.51 16.86,25.91 16.61,25.65 11.68,25.65 6.35,20.32 H2.29
PB13: length 19.2
  Top Layer w0.254: U0.52 17.36,25.65 16.85,25.15 12.45,25.15 6.35,19.05 3.81,19.05 H2.32
PB14: length 17.3
  Top Layer w0.254: H2.31 6.35,17.78 13.21,24.64 17.1,24.64 17.86,25.4 U0.53
PB15: length 21.5
  Top Layer w0.254: U0.54 18.36,25.15 17.34,24.13 13.97,24.13 6.35,16.51 3.81,16.51 H2.34
PC4: length 11.2
  Top Layer w0.254: H2.13 10.6,40.64 12.95,38.29 U0.30
PC5: length 14
  Top Layer w0.254: H2.16 3.81,39.37 11.12,39.37 12.7,37.79 U0.31
PC6: length 23.1
  Top Layer w0.254: U0.65 23.86,24.89 27.16,21.59 41.91,21.59 H1.29
PC7: length 19.5
  Top Layer w0.254: H1.28 35.35,22.86 34.58,22.1 27.41,22.1 24.36,25.15 U0.66
PC8: length 22
  Top Layer w0.254: H1.27 41.91,24.13 35.86,24.13 34.34,22.61 27.65,22.61 24.86,25.4 U0.67
PC9: length 18.4
  Top Layer w0.254: U0.68 25.36,25.65 27.9,23.11 34.09,23.11 36.38,25.4 H1.26
PC10: length 14.1
  Top Layer w0.254: H1.21 41.91,31.75 37.27,31.75 35.31,29.79 U0.79
PC11: length 11.4
  Top Layer w0.254: U0.80 35.05,30.29 37.78,33.02 H1.20
PC12: length 14.7
  Top Layer w0.254: H1.19 41.91,34.29 38.3,34.29 34.8,30.79 U0.81
PD0: length 12
  Top Layer w0.254: H1.18 38.81,35.56 34.54,31.29 U0.82
PD1: length 15.4
  Top Layer w0.254: U0.83 34.29,31.79 39.33,36.83 41.91,36.83 H1.17
PD2: length 12.9
  Top Layer w0.254: U0.84 34.04,32.29 38.1,36.35 38.1,36.83 39.37,38.1 H1.16
PD3: length 16.6
  Top Layer w0.254: H1.15 41.91,39.37 39.37,39.37 37.59,37.59 37.59,36.6 33.78,32.79 U0.85
PD4: length 14.2
  Top Layer w0.254: H1.14 39.37,40.64 37.08,38.35 37.08,36.85 33.53,33.29 U0.86
PD5: length 17.8
  Top Layer w0.254: U0.87 33.27,33.79 36.58,37.09 36.58,39.12 39.37,41.91 41.91,41.91 H1.13
PD6: length 15.4
  Top Layer w0.254: H1.12 39.37,43.18 36.07,39.88 36.07,37.34 33.02,34.29 U0.88
PD7: length 19.1
  Top Layer w0.254: U0.89 32.77,34.79 35.56,37.58 35.56,40.64 39.37,44.45 41.91,44.45 H1.11
PD8: length 19.6
  Top Layer w0.254: U0.55 18.86,24.89 17.59,23.62 14.73,23.62 6.35,15.24 H2.33
PD9: length 28.6
  Top Layer w0.254: H1.36 39.37,12.7 34.04,18.03 25.46,18.03 19.36,24.13 U0.56
PD10: length 30.5
  Top Layer w0.254: H1.35 41.91,13.97 39.37,13.97 34.8,18.54 25.7,18.54 19.86,24.38 U0.57
PD11: length 26.3
  Top Layer w0.254: H1.34 39.37,15.24 35.56,19.05 25.95,19.05 20.36,24.64 U0.58
PD12: length 28.2
  Top Layer w0.254: U0.59 20.86,24.89 26.19,19.56 36.32,19.56 39.37,16.51 41.91,16.51 H1.33
PD13: length 23.9
  Top Layer w0.254: H1.32 39.37,17.78 37.08,20.07 26.44,20.07 21.36,25.15 U0.60
PD14: length 25.8
  Top Layer w0.254: U0.61 21.86,25.4 26.69,20.57 37.85,20.57 39.37,19.05 41.91,19.05 H1.31
PD15: length 21.6
  Top Layer w0.254: U0.62 22.36,25.65 26.93,21.08 38.61,21.08 39.37,20.32 H1.30
PE0: length 20.2
  Top Layer w0.254: H1.4 39.37,53.34 32,45.97 32,39.3 31.5,38.79 U0.97
PE1: length 23.9
  Top Layer w0.254: U0.98 31.24,39.29 31.5,39.54 31.5,46.74 39.37,54.61 41.91,54.61 H1.3
PE7: length 13.3
  Top Layer w0.254: U0.38 3.81,34.29 H2.20
PE8: length 10.5
  Top Layer w0.254: U0.39 12.19,33.79 11.42,33.02 H2.19
PE9: length 13.9
  Top Layer w0.254: H2.22 3.81,31.75 10.91,31.75 12.45,33.29 U0.40
PE10: length 11.2
  Top Layer w0.254: U0.41 12.7,32.79 10.39,30.48 H2.21
PE11: length 14.6
  Top Layer w0.254: U0.42 12.95,32.29 9.87,29.21 3.81,29.21 H2.24
PE12: length 11.8
  Top Layer w0.254: H2.23 9.36,27.94 13.21,31.79 U0.43
PE13: length 15.2
  Top Layer w0.254: H2.26 3.81,26.67 8.84,26.67 13.46,31.29 U0.44
PE14: length 12.5
  Top Layer w0.254: H2.25 8.33,25.4 13.72,30.79 U0.45
PE15: length 15.8
  Top Layer w0.254: U0.46 13.97,30.29 7.81,24.13 3.81,24.13 H2.28
PF2: length 23
  Top Layer w0.254: U0.19 19.86,43.43 18.34,44.96 13.07,44.96 5.96,52.07 3.81,52.07 H2.6
PF9: length 30.2
  Top Layer w0.254: v1(23.86,39.79) 24.36,40.29 U0.10
  Bottom Layer w0.254: H2.4 3.81,54.61 9.04,54.61 v1(23.86,39.79)
PF10: length 25.9
  Top Layer w0.254: v1(22.86,39.79) 23.86,40.79 U0.11
  Bottom Layer w0.254: H2.3 9.31,53.34 v1(22.86,39.79)
SWCLK: length 25.3
  Top Layer w0.254: U0.77 29.36,28.79 v1(28.36,29.79)
  Bottom Layer w0.254: H0.1 26.67,28.1 v1(28.36,29.79)
SWDIO: length 23.8
  Top Layer w0.254: U0.76 28.86,28.29 v1(28.36,28.79)
  Bottom Layer w0.254: v1(28.36,28.79) 28.36,8.47 H0.2
UART_RX: length 41.5
  Top Layer w0.254: 7.42,5.5 8.38,5.5 arc(8.84,5.69) 9.02,6.15 v1(9.02,6.5) ; U0.71 26.86,28.79 26.19,29.46 25.53,29.46 v1(24.86,28.79)
  Bottom Layer w0.254: v1(9.02,6.5) 11.92,9.4 21.59,9.4 22.86,10.67 22.86,26.79 v1(24.86,28.79)
UART_TX: length 40.7
  Top Layer w0.254: U0.70 26.36,28.29 v1(25.86,28.79) ; 7.42,5 9.38,5 arc(9.84,5.19) 10.02,5.65 v1(10.02,6.5)
  Bottom Layer w0.254: v1(10.02,6.5) 12.41,8.89 22.23,8.89 23.49,10.16 23.49,26.42 v1(25.86,28.79)
USB_DN: length 10.5
  Top Layer w0.254: USB1.A7 18.03,8.26 arc(17.96,8.44) 17.78,8.51 17.28,8.51 arc(17.1,8.43) 17.03,8.25 USB1.B7 17.03,5.5 arc(16.88,5.15) 16.53,5 U5.2
USB_DP: length 11.7
  Top Layer w0.254: 18.53,6.73 18.53,5 arc(18.38,4.65) 18.03,4.5 U5.1 ; 18.53,6.73 USB1.B6 ; 18.53,6.73 arc(18.46,6.56) 18.28,6.48 17.78,6.48 arc(17.6,6.56) 17.53,6.73 USB1.A6
$1N2300: length 8.1
  Top Layer w0.254: R0.1 29.86,41.29 29.28,40.71 28.78,40.71 28.36,40.29 28.36,38.89 29.46,37.79 U0.95
$1N6766: length 4.6
  Top Layer w0.254: U1.4 R1.2
  Top Layer w0.508: C3.2 R1.2 R2.1
$1N7542: length 2.8
  Top Layer w0.508: U3.2 14.29,18.98 arc(14.56,19.66) 15.24,19.94 R3.1
$1N7546: length 3.3
  Top Layer w0.508: C20.1 R3.2 17.26,18.89 arc(17.12,18.56) U4.5
$1N7614: length 1.5
  Top Layer w0.508: R4.2 C21.1
$1N7775: length 6
  Top Layer w0.508: R6.1 R5.2 20.31,18.04 arc(20.57,17.41) 21.21,17.14 U4.3
$1N7848: length 1.5
  Top Layer w0.508: R7.2 C22.1
$1N8290: length 1.7
  Top Layer w0.254: LED0.1 5.03,60.44 R8.1
$1N8423: length 12.4
  Top Layer w0.254: LED1.4 39.88,59.26 34.21,53.59 32,53.59 31.75,53.34 R10.1
$1N8449: length 14.4
  Top Layer w0.254: LED1.3 39.62,60.11 33.61,54.1 30.73,54.1 30.23,53.59 R11.1
$1N8483: length 12.1
  Top Layer w0.254: LED1.1 41.81,58.41 40.13,58.41 34.54,52.82 R9.1
$1N10078: length 12.9
  Top Layer w0.254: v1(16.28,5.75) 16.53,6 USB1.A5
  Bottom Layer w0.254: v1(9.52,1.28) 15.78,1.28 arc(16.13,1.42) 16.28,1.78 v1(16.28,5.75)
$1N10082: length 14.5
  Top Layer w0.254: USB1.B5 19.53,1.78 arc(19.38,1.42) 19.03,1.28 R18.1

## Copper pours and planes (outline as drawn; the poured copper is in the pictures)
3V3 on Top Layer: 24.13,16.51 26.92,16.51 26.92,12.57 24.13,12.57
5V0 on Top Layer: 36.83,12.57 31.75,12.57 31.75,14.39 30.99,14.39 30.99,16.38 33.27,16.38 33.27,13.59 36.83,13.59
5V0 on Top Layer: 11.68,12.57 10.67,12.57 10.67,17.4 12.07,18.8 12.7,18.8 12.7,17.4 13.21,17.4 13.21,16.26 14.22,16.26 14.22,17.4 14.99,17.4 14.99,16.2 14.54,15.75 12.45,15.75 11.68,14.99
AGND on Top Layer: 0,60.96 0.01,61.2 0.06,61.51 0.15,61.82 0.28,62.11 0.44,62.39 0.63,62.64 0.86,62.87 1.11,63.06 1.39,63.22 1.68,63.35 1.99,63.44 2.3,63.49 2.54,63.5 43.18,63.5 43.42,63.49 43.73,63.44 44.04,63.35 44.33,63.22 44.61,63.06 44.86,62.87 45.09,62.64 45.28,62.39 45.44,62.11 45.57,61.82 45.66,61.51 45.71,61.2 45.72,60.96 45.72,2.54 45.71,2.3 45.66,1.99 45.57,1.68 45.44,1.39 45.28,1.11 45.09,0.86 44.86,0.63 44.61,0.44 44.33,0.28 44.04,0.15 43.73,0.06 43.42,0.01 43.18,0 2.54,0 2.3,0.01 1.99,0.06 1.68,0.15 1.39,0.28 1.11,0.44 0.86,0.63 0.63,0.86 0.44,1.11 0.28,1.39 0.15,1.68 0.06,1.99 0.01,2.3 0,2.54
AGND on Bottom Layer: 0,60.96 0.01,61.2 0.06,61.51 0.15,61.82 0.28,62.11 0.44,62.39 0.63,62.64 0.86,62.87 1.11,63.06 1.39,63.22 1.68,63.35 1.99,63.44 2.3,63.49 2.54,63.5 43.18,63.5 43.42,63.49 43.73,63.44 44.04,63.35 44.33,63.22 44.61,63.06 44.86,62.87 45.09,62.64 45.28,62.39 45.44,62.11 45.57,61.82 45.66,61.51 45.71,61.2 45.72,60.96 45.72,2.54 45.71,2.3 45.66,1.99 45.57,1.68 45.44,1.39 45.28,1.11 45.09,0.86 44.86,0.63 44.61,0.44 44.33,0.28 44.04,0.15 43.73,0.06 43.42,0.01 43.18,0 2.54,0 2.3,0.01 1.99,0.06 1.68,0.15 1.39,0.28 1.11,0.44 0.86,0.63 0.63,0.86 0.44,1.11 0.28,1.39 0.15,1.68 0.06,1.99 0.01,2.3 0,2.54
AGND on Inner1: 0,60.96 0.01,61.2 0.06,61.51 0.15,61.82 0.28,62.11 0.44,62.39 0.63,62.64 0.86,62.87 1.11,63.06 1.39,63.22 1.68,63.35 1.99,63.44 2.3,63.49 2.54,63.5 43.18,63.5 43.42,63.49 43.73,63.44 44.04,63.35 44.33,63.22 44.61,63.06 44.86,62.87 45.09,62.64 45.28,62.39 45.44,62.11 45.57,61.82 45.66,61.51 45.71,61.2 45.72,60.96 45.72,2.54 45.71,2.3 45.66,1.99 45.57,1.68 45.44,1.39 45.28,1.11 45.09,0.86 44.86,0.63 44.61,0.44 44.33,0.28 44.04,0.15 43.73,0.06 43.42,0.01 43.18,0 2.54,0 2.3,0.01 1.99,0.06 1.68,0.15 1.39,0.28 1.11,0.44 0.86,0.63 0.63,0.86 0.44,1.11 0.28,1.39 0.15,1.68 0.06,1.99 0.01,2.3 0,2.54
AGND on Inner2: 0,60.96 0.01,61.2 0.06,61.51 0.15,61.82 0.28,62.11 0.44,62.39 0.63,62.64 0.86,62.87 1.11,63.06 1.39,63.22 1.68,63.35 1.99,63.44 2.3,63.49 2.54,63.5 43.18,63.5 43.42,63.49 43.73,63.44 44.04,63.35 44.33,63.22 44.61,63.06 44.86,62.87 45.09,62.64 45.28,62.39 45.44,62.11 45.57,61.82 45.66,61.51 45.71,61.2 45.72,60.96 45.72,2.54 45.71,2.3 45.66,1.99 45.57,1.68 45.44,1.39 45.28,1.11 45.09,0.86 44.86,0.63 44.61,0.44 44.33,0.28 44.04,0.15 43.73,0.06 43.42,0.01 43.18,0 2.54,0 2.3,0.01 1.99,0.06 1.68,0.15 1.39,0.28 1.11,0.44 0.86,0.63 0.63,0.86 0.44,1.11 0.28,1.39 0.15,1.68 0.06,1.99 0.01,2.3 0,2.54
3A3 on Top Layer: 13.72,15.24 18.29,15.24 18.29,13.97 16.26,13.97 16.26,11.05 14.99,9.78 13.72,9.78
$1N6263 on Top Layer: 27.11,14.22 27.11,16.51 28.31,16.51 28.31,15.87 29.72,15.87 29.72,15.37 28.31,15.37 28.31,14.22

## Text on the board
Bottom Silkscreen Layer: G | F9 | F2 | A1 | A3 | A5 | A7 | C5 | B1 | E7 | E9 | E11 | E13 | E15 | B11 | B13 | B15 | 3R0 | 3V3 | F10 | A0 | A2 | A4 | A6 | C4 | B0 | B2 | E8 | E10 | E12 | E14 | B10 | B12 | B14 | D8 | 1R5 | 3A3 | E0 | B7 | B5 | B3 | D6 | D4 | D2 | D0 | C11 | A15 | A11 | C9 | C7 | D15 | D13 | D11 | D9 | 5V0 | E1 | B9 | B6 | B4 | D7 | D5 | D3 | D1 | C12 | C10 | A12 | A8 | C8 | C6 | D14 | D12 | D10 | E2 | E6 | E5 | E4 | E3
Top Silkscreen Layer: G | F9 | F2 | A1 | A3 | A5 | A7 | C5 | B1 | E7 | E9 | E11 | E13 | E15 | B11 | B13 | B15 | 3R0 | 3V3 | E0 | B7 | B5 | B3 | D6 | D4 | D2 | D0 | C11 | A15 | A11 | C9 | C7 | D15 | D13 | D11 | D9 | 5V | F10 | A0 | A2 | A4 | A6 | C4 | B0 | B2 | E8 | E10 | E12 | E14 | B10 | B12 | B14 | D8 | 1R5 | 3A3 | 24 MHz | E1 | B9 | B6 | B4 | D7 | D5 | D3 | D1 | C12 | C10 | A12 | A8 | C8 | C6 | D14 | D12 | D10 | KEY4 | KEY3 | KEY2 | KEY1 | RST | UART1 | CLK | DIO | GND | Penguins v1.0 | G474VET6
